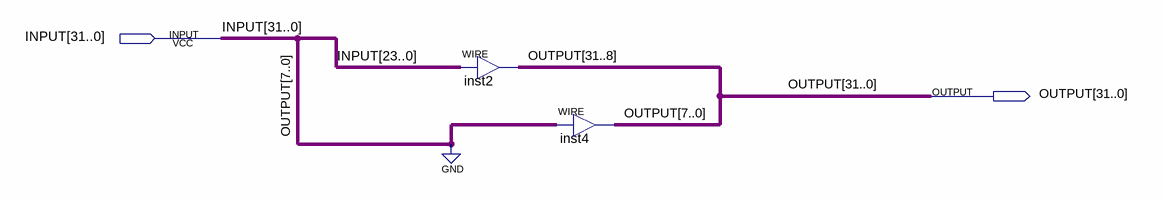
[diagram p0: schematic sheet]
// Quartus schematic SLL8.bdf as structural Verilog: 2 symbols, 2 pins
module SLL8 (
  input  [31:0] INPUT,
  output [31:0] OUTPUT
);

  assign OUTPUT[31:8] = INPUT[23:0];  // WIRE inst2
  assign OUTPUT[7:0] = OUTPUT[7:0];  // WIRE inst4
  // also tied to GND on the sheet: {OUTPUT[0], OUTPUT[1], OUTPUT[2], OUTPUT[3], OUTPUT[4], OUTPUT[5], OUTPUT[6], OUTPUT[7]}
endmodule
